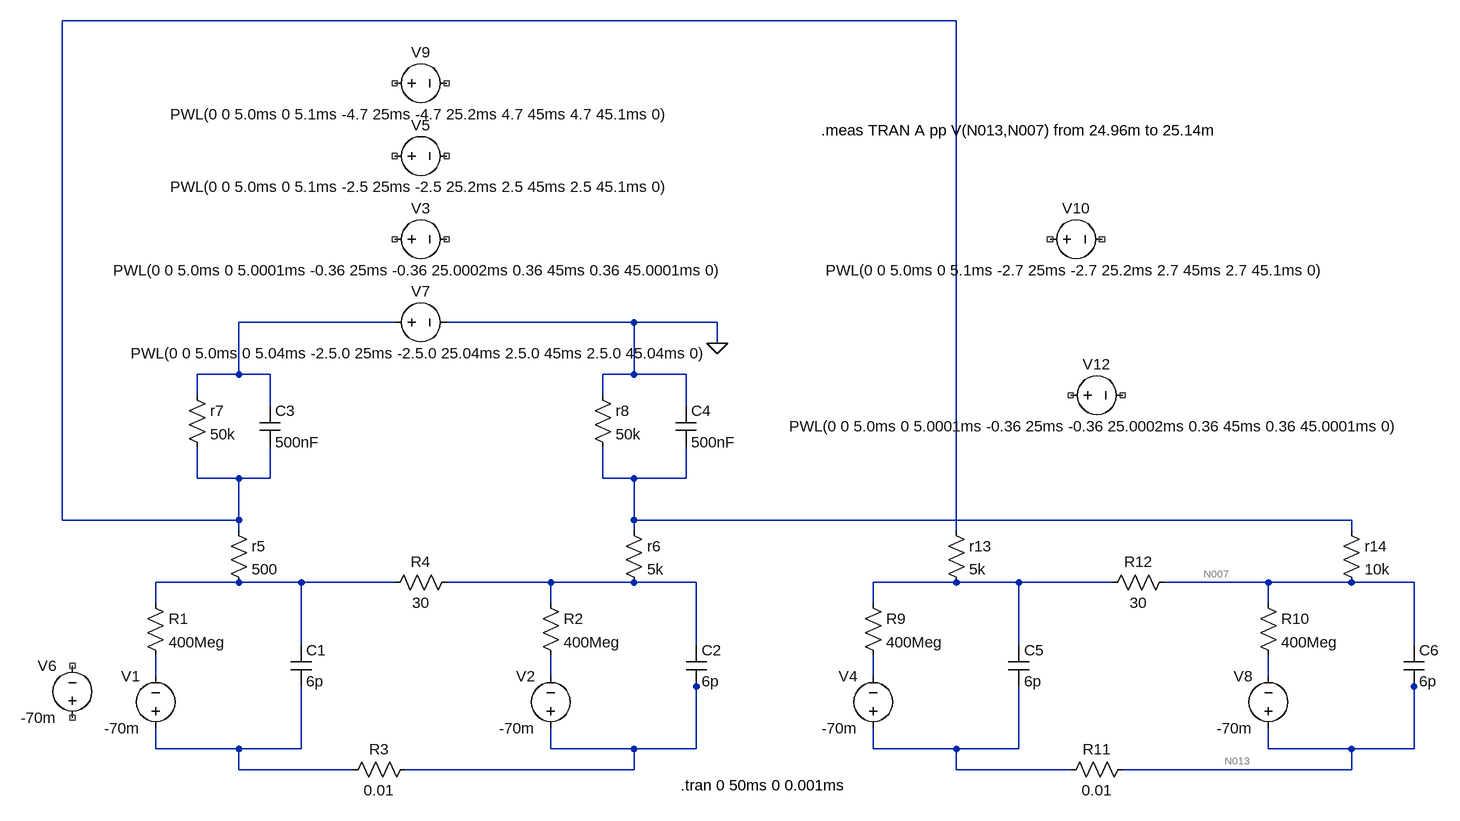
[diagram p0: schematic 電圧刺激等価回路_20210128.asc]
電圧刺激等価回路_20210128.asc, the LTspice schematic file:
Version 4
SHEET 1 1992 680
WIRE 1232 -832 -144 -832
WIRE 368 -368 128 -368
WIRE 736 -368 448 -368
WIRE 864 -368 736 -368
WIRE 864 -336 864 -368
WIRE 128 -288 128 -368
WIRE 128 -288 64 -288
WIRE 176 -288 128 -288
WIRE 736 -288 736 -368
WIRE 736 -288 688 -288
WIRE 816 -288 736 -288
WIRE 64 -256 64 -288
WIRE 688 -256 688 -288
WIRE 176 -240 176 -288
WIRE 816 -240 816 -288
WIRE 64 -128 64 -176
WIRE 128 -128 64 -128
WIRE 176 -128 176 -176
WIRE 176 -128 128 -128
WIRE 688 -128 688 -176
WIRE 736 -128 688 -128
WIRE 816 -128 816 -176
WIRE 816 -128 736 -128
WIRE -144 -64 -144 -832
WIRE 128 -64 128 -128
WIRE 128 -64 -144 -64
WIRE 736 -64 736 -128
WIRE 1840 -64 736 -64
WIRE 128 -48 128 -64
WIRE 736 -48 736 -64
WIRE 1232 -48 1232 -832
WIRE 1840 -48 1840 -64
WIRE 128 32 0 32
WIRE 224 32 128 32
WIRE 368 32 224 32
WIRE 608 32 448 32
WIRE 736 32 608 32
WIRE 832 32 736 32
WIRE 1232 32 1104 32
WIRE 1328 32 1232 32
WIRE 1472 32 1328 32
WIRE 1712 32 1552 32
WIRE 1840 32 1712 32
WIRE 1936 32 1840 32
WIRE 0 64 0 32
WIRE 608 64 608 32
WIRE 1104 64 1104 32
WIRE 1712 64 1712 32
WIRE 224 128 224 32
WIRE 832 128 832 32
WIRE 1328 128 1328 32
WIRE 1936 128 1936 32
WIRE 0 176 0 144
WIRE 608 176 608 144
WIRE 1104 176 1104 144
WIRE 1712 176 1712 144
WIRE 832 192 832 176
WIRE 1936 192 1936 176
WIRE 0 288 0 256
WIRE 128 288 0 288
WIRE 224 288 224 192
WIRE 224 288 128 288
WIRE 608 288 608 256
WIRE 736 288 608 288
WIRE 832 288 832 192
WIRE 832 288 736 288
WIRE 1104 288 1104 256
WIRE 1232 288 1104 288
WIRE 1328 288 1328 192
WIRE 1328 288 1232 288
WIRE 1712 288 1712 256
WIRE 1840 288 1712 288
WIRE 1936 288 1936 192
WIRE 1936 288 1840 288
WIRE 128 320 128 288
WIRE 304 320 128 320
WIRE 736 320 736 288
WIRE 736 320 384 320
WIRE 1232 320 1232 288
WIRE 1408 320 1232 320
WIRE 1840 320 1840 288
WIRE 1840 320 1488 320
FLAG 864 -336 0
SYMBOL res -16 48 R0
SYMATTR InstName R1
SYMATTR Value 400Meg
SYMBOL res 592 48 R0
SYMATTR InstName R2
SYMATTR Value 400Meg
SYMBOL res 400 304 R90
WINDOW 0 0 56 VBottom 2
WINDOW 3 32 56 VTop 2
SYMATTR InstName R3
SYMATTR Value 0.01
SYMBOL res 112 -64 R0
SYMATTR InstName r5
SYMATTR Value 500
SYMBOL res 720 -64 R0
SYMATTR InstName r6
SYMATTR Value 5k
SYMBOL cap 208 128 R0
SYMATTR InstName C1
SYMATTR Value 6p
SYMBOL cap 816 128 R0
SYMATTR InstName C2
SYMATTR Value 6p
SYMBOL cap 160 -240 R0
SYMATTR InstName C3
SYMATTR Value 500nF
SYMBOL cap 800 -240 R0
SYMATTR InstName C4
SYMATTR Value 500nF
SYMBOL res 48 -272 R0
SYMATTR InstName r7
SYMATTR Value 50k
SYMBOL res 672 -272 R0
SYMATTR InstName r8
SYMATTR Value 50k
SYMBOL voltage 0 272 R180
WINDOW 0 24 96 Left 2
WINDOW 3 24 16 Left 2
SYMATTR InstName V1
SYMATTR Value -70m
SYMBOL voltage 608 272 R180
WINDOW 0 24 96 Left 2
WINDOW 3 24 16 Left 2
SYMATTR InstName V2
SYMATTR Value -70m
SYMBOL res 464 16 R90
WINDOW 0 0 56 VBottom 2
WINDOW 3 32 56 VTop 2
SYMATTR InstName R4
SYMATTR Value 30
SYMBOL voltage 352 -624 R270
WINDOW 0 32 56 VTop 2
WINDOW 3 -32 56 VBottom 2
WINDOW 123 0 0 Left 0
WINDOW 39 0 0 Left 0
SYMATTR InstName V5
SYMATTR Value PWL(0 0 5.0ms 0 5.1ms -2.5 25ms -2.5 25.2ms 2.5 45ms 2.5 45.1ms 0)
SYMBOL voltage -128 256 R180
WINDOW 0 24 96 Left 2
WINDOW 3 24 16 Left 2
SYMATTR InstName V6
SYMATTR Value -70m
SYMBOL voltage 352 -496 R270
WINDOW 0 32 56 VTop 2
WINDOW 3 -32 56 VBottom 2
WINDOW 123 0 0 Left 0
WINDOW 39 0 0 Left 0
SYMATTR InstName V3
SYMATTR Value PWL(0 0 5.0ms 0 5.0001ms -0.36 25ms -0.36 25.0002ms 0.36 45ms 0.36 45.0001ms 0)
SYMBOL res 1088 48 R0
SYMATTR InstName R9
SYMATTR Value 400Meg
SYMBOL res 1696 48 R0
SYMATTR InstName R10
SYMATTR Value 400Meg
SYMBOL res 1504 304 R90
WINDOW 0 0 56 VBottom 2
WINDOW 3 32 56 VTop 2
SYMATTR InstName R11
SYMATTR Value 0.01
SYMBOL cap 1312 128 R0
SYMATTR InstName C5
SYMATTR Value 6p
SYMBOL cap 1920 128 R0
SYMATTR InstName C6
SYMATTR Value 6p
SYMBOL voltage 1104 272 R180
WINDOW 0 24 96 Left 2
WINDOW 3 24 16 Left 2
SYMATTR InstName V4
SYMATTR Value -70m
SYMBOL voltage 1712 272 R180
WINDOW 0 24 96 Left 2
WINDOW 3 24 16 Left 2
SYMATTR InstName V8
SYMATTR Value -70m
SYMBOL res 1568 16 R90
WINDOW 0 0 56 VBottom 2
WINDOW 3 32 56 VTop 2
SYMATTR InstName R12
SYMATTR Value 30
SYMBOL res 1216 -64 R0
SYMATTR InstName r13
SYMATTR Value 5k
SYMBOL res 1824 -64 R0
SYMATTR InstName r14
SYMATTR Value 10k
SYMBOL voltage 352 -736 R270
WINDOW 0 32 56 VTop 2
WINDOW 3 -32 56 VBottom 2
WINDOW 123 0 0 Left 0
WINDOW 39 0 0 Left 0
SYMATTR InstName V9
SYMATTR Value PWL(0 0 5.0ms 0 5.1ms -4.7 25ms -4.7 25.2ms 4.7 45ms 4.7 45.1ms 0)
SYMBOL voltage 1360 -496 R270
WINDOW 0 32 56 VTop 2
WINDOW 3 -32 56 VBottom 2
WINDOW 123 0 0 Left 0
WINDOW 39 0 0 Left 0
SYMATTR InstName V10
SYMATTR Value PWL(0 0 5.0ms 0 5.1ms -2.7 25ms -2.7 25.2ms 2.7 45ms 2.7 45.1ms 0)
SYMBOL voltage 1392 -256 R270
WINDOW 0 32 56 VTop 2
WINDOW 3 -32 56 VBottom 2
WINDOW 123 0 0 Left 0
WINDOW 39 0 0 Left 0
SYMATTR InstName V12
SYMATTR Value PWL(0 0 5.0ms 0 5.0001ms -0.36 25ms -0.36 25.0002ms 0.36 45ms 0.36 45.0001ms 0)
SYMBOL voltage 352 -368 R270
WINDOW 0 32 56 VTop 2
WINDOW 3 -32 56 VBottom 2
WINDOW 123 0 0 Left 0
WINDOW 39 0 0 Left 0
SYMATTR InstName V7
SYMATTR Value PWL(0 0 5.0ms 0 5.04ms -2.5.0 25ms -2.5.0 25.04ms 2.5.0 45ms 2.5.0 45.04ms 0)
TEXT 808 344 Left 2 !.tran 0 50ms 0 0.001ms
TEXT 1024 -664 Left 2 !.meas TRAN A pp V(N013,N007) from 24.96m to 25.14m

The netlist it stands for:
* 電圧刺激等価回路_20210128.asc
R1 N004 N008 400Meg
R2 N005 N009 400Meg
R3 N012 N014 0.01
r5 N001 N004 500
r6 N003 N005 5k
C1 N004 N014 6p
C2 N005 N012 6p
C3 N002 N001 500nF
C4 0 N003 500nF
r7 N002 N001 50k
r8 0 N003 50k
V1 N014 N008 -70m
V2 N012 N009 -70m
R4 N005 N004 30
V5 NC_01 NC_02 PWL(0 0 5.0ms 0 5.1ms -2.5 25ms -2.5 25.2ms 2.5 45ms 2.5 45.1ms 0)
V6 NC_03 NC_04 -70m
V3 NC_05 NC_06 PWL(0 0 5.0ms 0 5.0001ms -0.36 25ms -0.36 25.0002ms 0.36 45ms 0.36 45.0001ms 0)
R9 N006 N010 400Meg
R10 N007 N011 400Meg
R11 N013 N015 0.01
C5 N006 N015 6p
C6 N007 N013 6p
V4 N015 N010 -70m
V8 N013 N011 -70m
R12 N007 N006 30
r13 N001 N006 5k
r14 N003 N007 10k
V9 NC_07 NC_08 PWL(0 0 5.0ms 0 5.1ms -4.7 25ms -4.7 25.2ms 4.7 45ms 4.7 45.1ms 0)
V10 NC_09 NC_10 PWL(0 0 5.0ms 0 5.1ms -2.7 25ms -2.7 25.2ms 2.7 45ms 2.7 45.1ms 0)
V12 NC_11 NC_12 PWL(0 0 5.0ms 0 5.0001ms -0.36 25ms -0.36 25.0002ms 0.36 45ms 0.36 45.0001ms 0)
V7 N002 0 PWL(0 0 5.0ms 0 5.04ms -2.5.0 25ms -2.5.0 25.04ms 2.5.0 45ms 2.5.0 45.04ms 0)
.tran 0 50ms 0 0.001ms
.meas TRAN A pp V(N013,N007) from 24.96m to 25.14m
.backanno
.end